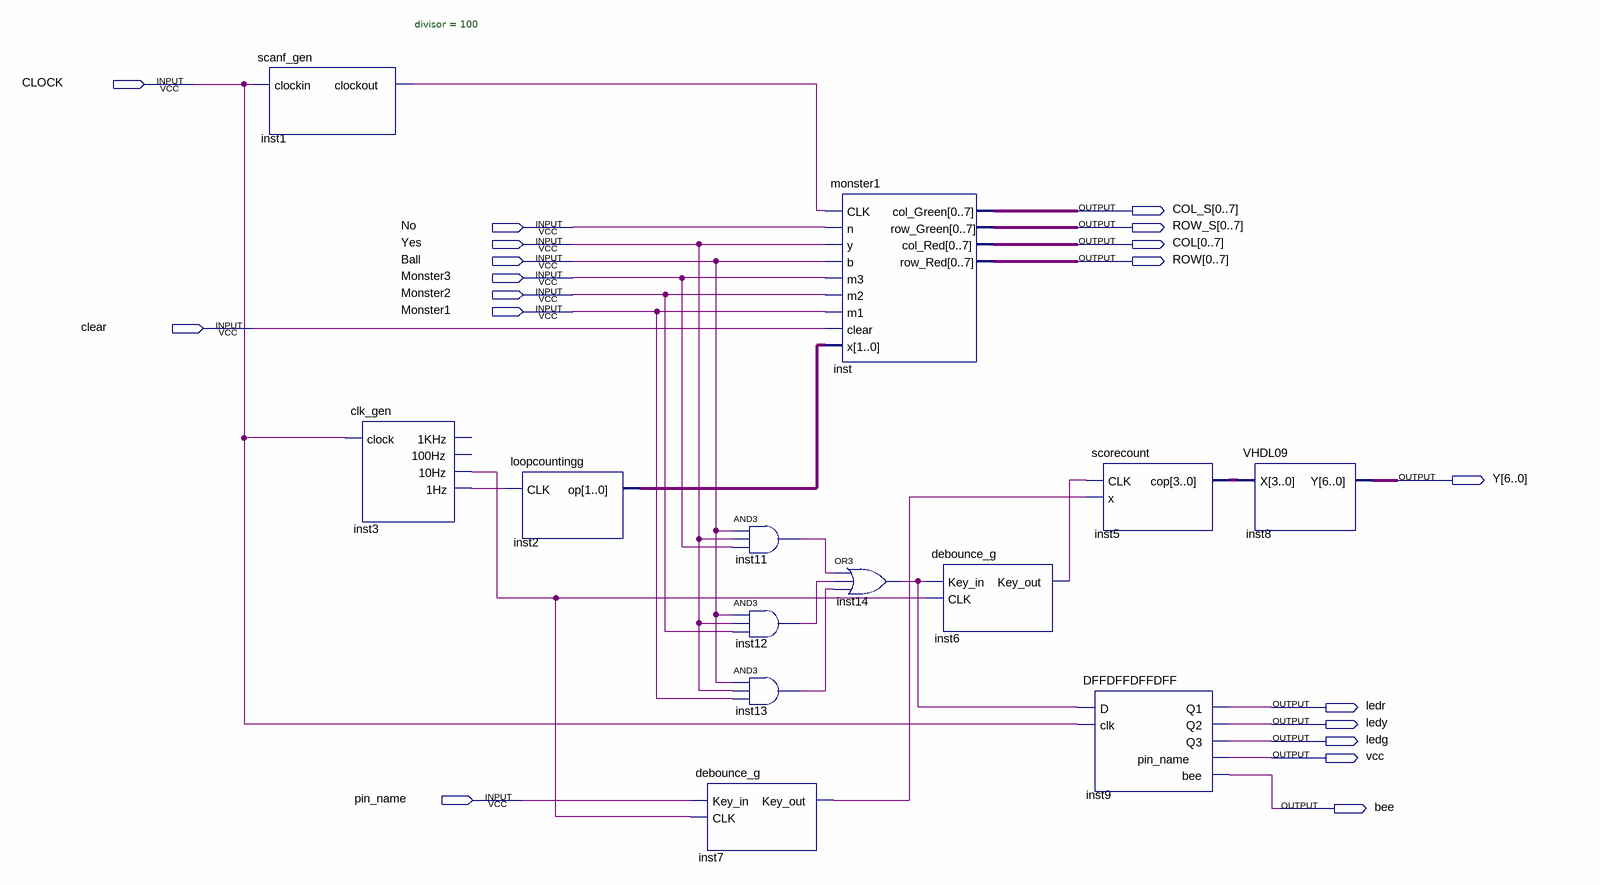
[diagram p0: schematic sheet]
// Quartus schematic 8X8.bdf as structural Verilog: 13 symbols, 19 pins
module \8X8  (
  input  CLOCK,
  input  No,
  input  Yes,
  input  Ball,
  input  Monster3,
  input  Monster2,
  input  Monster1,
  input  clear,
  input  pin_name,
  output [0:7] COL_S,
  output [0:7] ROW_S,
  output [0:7] COL,
  output [0:7] ROW,
  output [6:0] Y,
  output ledr,
  output ledy,
  output ledg,
  output vcc,
  output bee
);

  wire inst1_clockout, inst3_1hz, inst3_10hz, inst6_key_out, inst7_key_out, inst11_out, inst12_out,
       inst13_out, inst14_out;
  wire [1:0] inst2_op;
  wire [3:0] inst5_cop;

  scanf_gen #(.divisor(100)) inst1 (.clockin(CLOCK), .clockout(inst1_clockout));
  clk_gen inst3 (.clock(CLOCK), .\10Hz (inst3_10hz), .\1Hz (inst3_1hz));  // open: 1KHz, 100Hz
  loopcountingg inst2 (.CLK(inst3_1hz), .op(inst2_op));
  and inst11 (inst11_out, Ball, Yes, Monster3);
  and inst12 (inst12_out, Ball, Yes, Monster2);
  and inst13 (inst13_out, Ball, Yes, Monster1);
  debounce_g inst7 (.Key_in(pin_name), .CLK(inst3_10hz), .Key_out(inst7_key_out));
  monster1 inst (
    .CLK(inst1_clockout), .n(No), .y(Yes), .b(Ball), .m3(Monster3), .m2(Monster2), .m1(Monster1),
    .clear(clear), .x(inst2_op), .col_Green(COL_S), .row_Green(ROW_S), .col_Red(COL), .row_Red(ROW));
  or inst14 (inst14_out, inst11_out, inst12_out, inst13_out);
  debounce_g inst6 (.Key_in(inst14_out), .CLK(inst3_10hz), .Key_out(inst6_key_out));
  scorecount inst5 (.CLK(inst6_key_out), .x(inst7_key_out), .cop(inst5_cop));
  DFFDFFDFFDFF inst9 (.D(inst14_out), .clk(CLOCK), .Q1(ledr), .Q2(ledy), .Q3(ledg), .pin_name(vcc), .bee(bee));
  VHDL09 inst8 (.X(inst5_cop), .Y(Y));
endmodule
